# Altium schematic sheet Схема дискретных входов и выходов.SchDoc
size A2; SheetNumber: 6; SheetTotal: 6
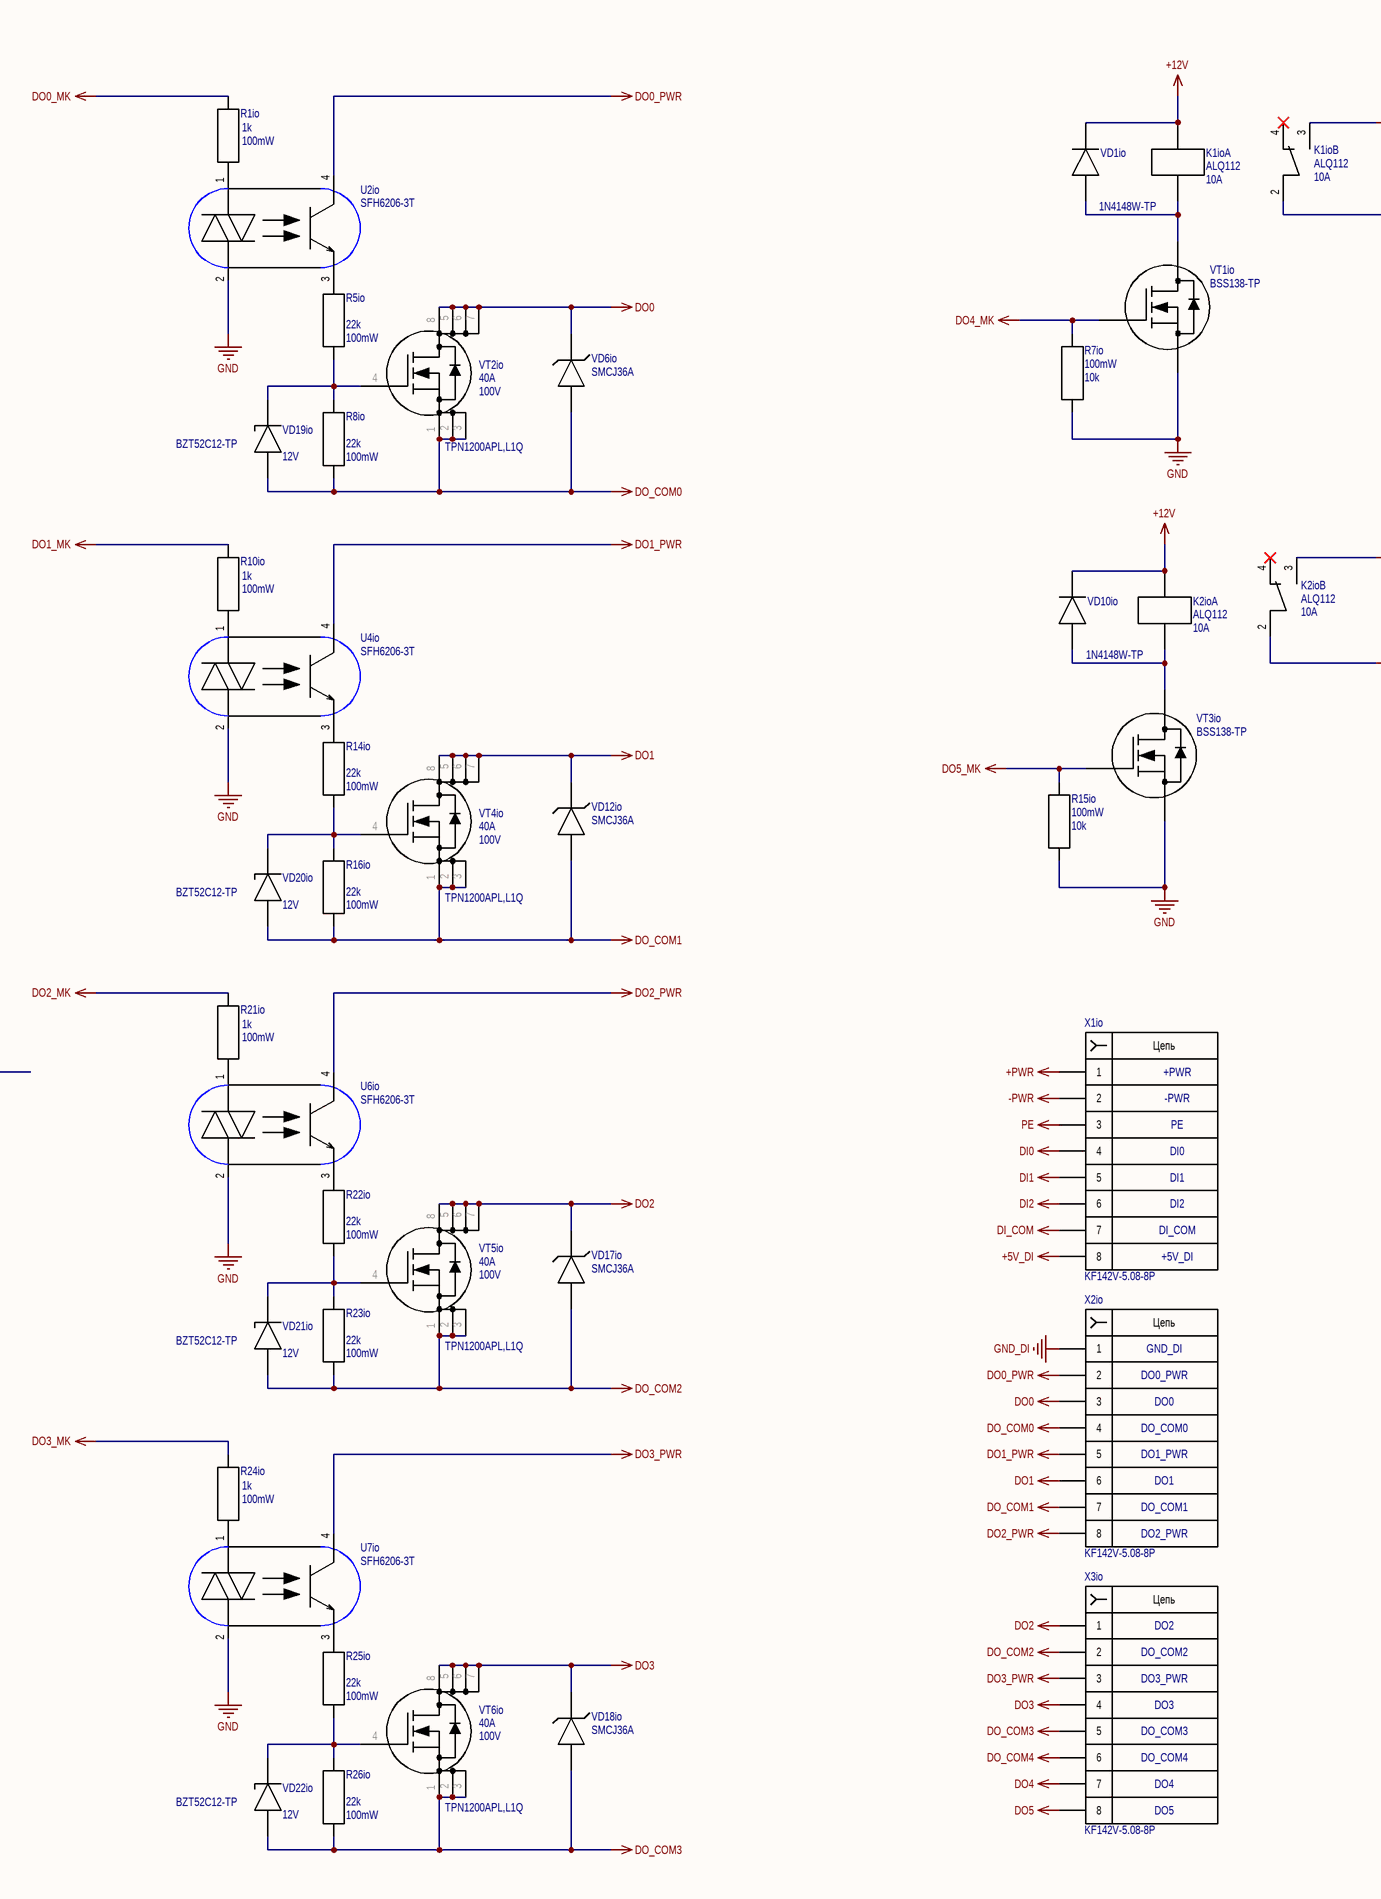
[diagram p0: Схема дискретных входов и выходов.SchDoc, left]
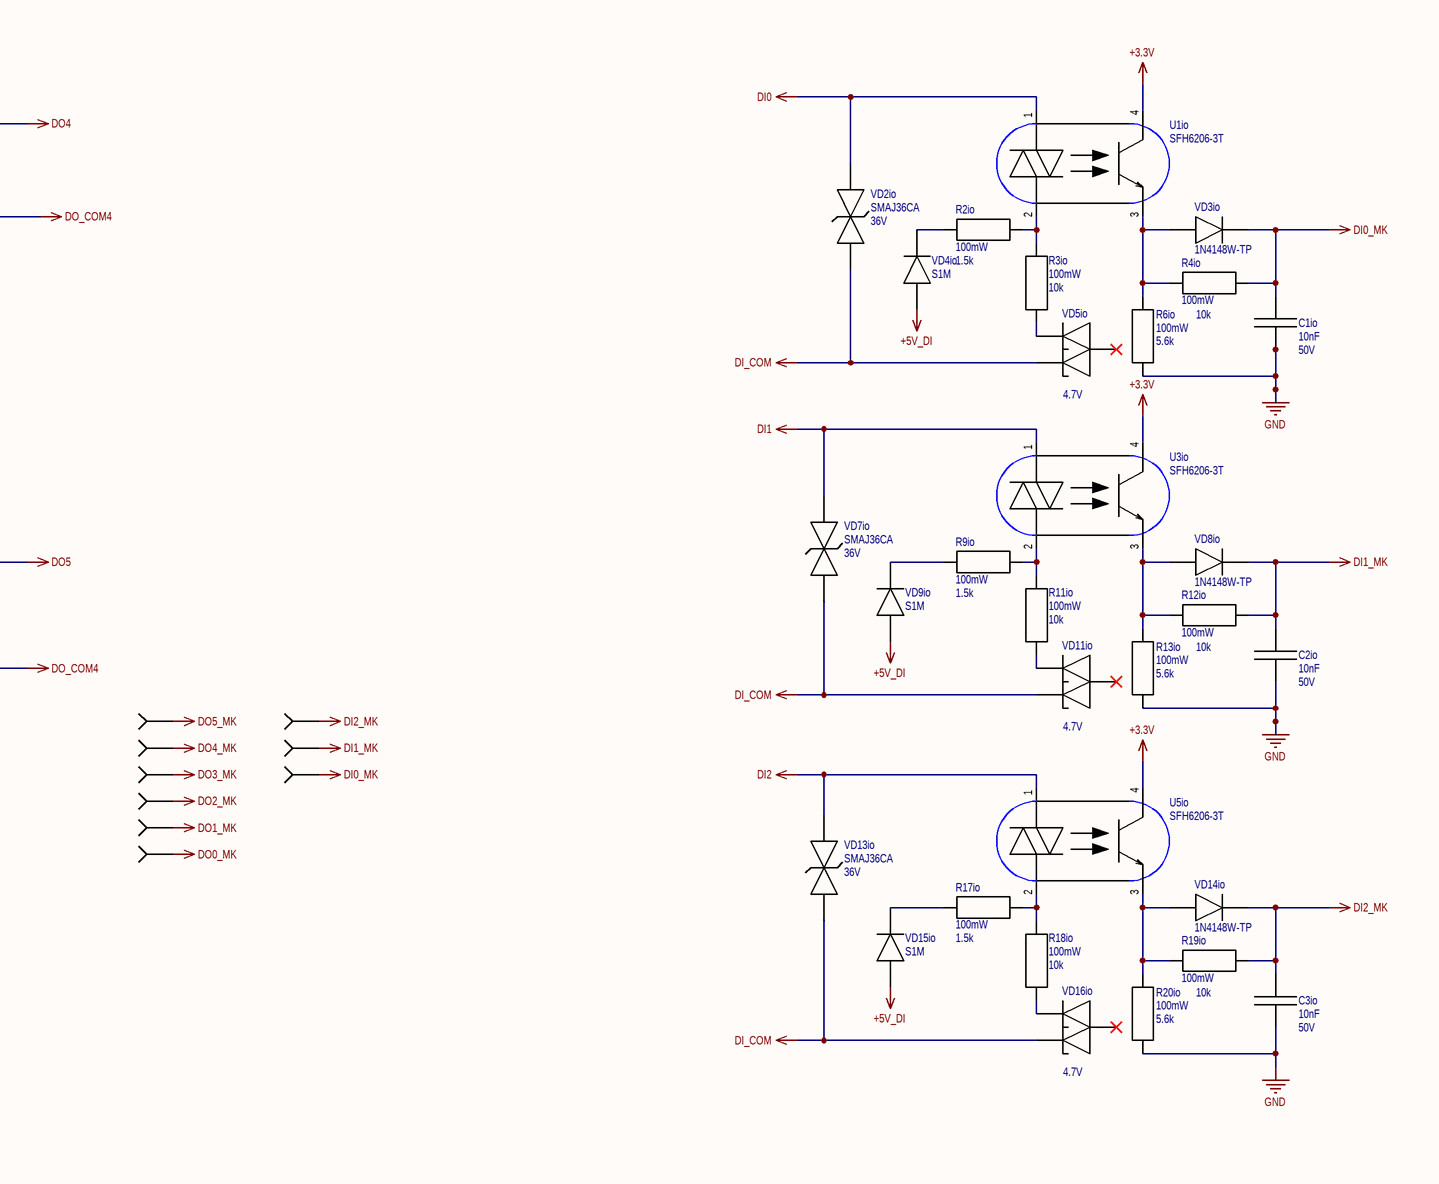
[diagram p1: Схема дискретных входов и выходов.SchDoc, right]

## Parts
C1io  Capacitance: 10nF  Rated Voltage: 50V  [CAP 0603 IPC MAX]  (hidden comment: CL10B103KB8NNNC)
C2io  Capacitance: 10nF  Rated Voltage: 50V  [CAP 0603 IPC MAX]  (hidden comment: CL10B103KB8NNNC)
C3io  Capacitance: 10nF  Rated Voltage: 50V  [CAP 0603 IPC MAX]  (hidden comment: CL10B103KB8NNNC)
K1io  ALQ112  Contact Rating: 10A  [ALQ112]  (parts A,B of 2)
K2io  ALQ112  Contact Rating: 10A  [ALQ112]  (parts A,B of 2)
R1io  Resistance: 1k  Rated Power: 100mW  [RES 0603 IPC MAX]  (hidden comment: RMCF0603FT1K00)
R2io  Power Rated: 100mW  Resistance: 1.5k  [CAP 0603 IPC MAX]  (hidden comment: RMCF0603FT1K50)
R3io  Power Rated: 100mW  Resistance: 10k  [RES 0603 IPC MAX]  (hidden comment: RMCF0603JT10K0)
R4io  Power Rated: 100mW  Resistance: 10k  [RES 0603 IPC MAX]  (hidden comment: RMCF0603JT10K0)
R5io  Resistance: 22k  Power Rated: 100mW  [RES 0603 IPC MAX]  (hidden comment: RMCF0603FT22K0)
R6io  Resistance: 5.6k  Rated Power: 100mW  [RES 0603 IPC MAX]  (hidden comment: RMCF0603FT5K60)
R7io  Power Rated: 100mW  Resistance: 10k  [RES 0603 IPC MAX]  (hidden comment: RMCF0603JT10K0)
R8io  Resistance: 22k  Power Rated: 100mW  [RES 0603 IPC MAX]  (hidden comment: RMCF0603FT22K0)
R9io  Power Rated: 100mW  Resistance: 1.5k  [CAP 0603 IPC MAX]  (hidden comment: RMCF0603FT1K50)
R10io  Resistance: 1k  Rated Power: 100mW  [RES 0603 IPC MAX]  (hidden comment: RMCF0603FT1K00)
R11io  Power Rated: 100mW  Resistance: 10k  [RES 0603 IPC MAX]  (hidden comment: RMCF0603JT10K0)
R12io  Power Rated: 100mW  Resistance: 10k  [RES 0603 IPC MAX]  (hidden comment: RMCF0603JT10K0)
R13io  Resistance: 5.6k  Rated Power: 100mW  [RES 0603 IPC MAX]  (hidden comment: RMCF0603FT5K60)
R14io  Resistance: 22k  Power Rated: 100mW  [RES 0603 IPC MAX]  (hidden comment: RMCF0603FT22K0)
R15io  Power Rated: 100mW  Resistance: 10k  [RES 0603 IPC MAX]  (hidden comment: RMCF0603JT10K0)
R16io  Resistance: 22k  Power Rated: 100mW  [RES 0603 IPC MAX]  (hidden comment: RMCF0603FT22K0)
R17io  Power Rated: 100mW  Resistance: 1.5k  [CAP 0603 IPC MAX]  (hidden comment: RMCF0603FT1K50)
R18io  Power Rated: 100mW  Resistance: 10k  [RES 0603 IPC MAX]  (hidden comment: RMCF0603JT10K0)
R19io  Power Rated: 100mW  Resistance: 10k  [RES 0603 IPC MAX]  (hidden comment: RMCF0603JT10K0)
R20io  Resistance: 5.6k  Rated Power: 100mW  [RES 0603 IPC MAX]  (hidden comment: RMCF0603FT5K60)
R21io  Resistance: 1k  Rated Power: 100mW  [RES 0603 IPC MAX]  (hidden comment: RMCF0603FT1K00)
R22io  Resistance: 22k  Power Rated: 100mW  [RES 0603 IPC MAX]  (hidden comment: RMCF0603FT22K0)
R23io  Resistance: 22k  Power Rated: 100mW  [RES 0603 IPC MAX]  (hidden comment: RMCF0603FT22K0)
R24io  Resistance: 1k  Rated Power: 100mW  [RES 0603 IPC MAX]  (hidden comment: RMCF0603FT1K00)
R25io  Resistance: 22k  Power Rated: 100mW  [RES 0603 IPC MAX]  (hidden comment: RMCF0603FT22K0)
R26io  Resistance: 22k  Power Rated: 100mW  [RES 0603 IPC MAX]  (hidden comment: RMCF0603FT22K0)
TP1io  1.2MM TP  [TESTPOINT 1.2mm]  (value not drawn)  (no BOM)
TP2io  1.2MM TP  [TESTPOINT 1.2mm]  (value not drawn)  (no BOM)
TP3io  1.2MM TP  [TESTPOINT 1.2mm]  (value not drawn)  (no BOM)
TP4io  1.2MM TP  [TESTPOINT 1.2mm]  (value not drawn)  (no BOM)
TP5io  1.2MM TP  [TESTPOINT 1.2mm]  (value not drawn)  (no BOM)
TP6io  1.2MM TP  [TESTPOINT 1.2mm]  (value not drawn)  (no BOM)
TP7io  1.2MM TP  [TESTPOINT 1.2mm]  (value not drawn)  (no BOM)
TP9io  1.2MM TP  [TESTPOINT 1.2mm]  (value not drawn)  (no BOM)
TP11io  1.2MM TP  [TESTPOINT 1.2mm]  (value not drawn)  (no BOM)
U1io  SFH6206-3T  [11-5L106]
U2io  SFH6206-3T  [11-5L106]
U3io  SFH6206-3T  [11-5L106]
U4io  SFH6206-3T  [11-5L106]
U5io  SFH6206-3T  [11-5L106]
U6io  SFH6206-3T  [11-5L106]
U7io  SFH6206-3T  [11-5L106]
VD1io  1N4148W-TP  [SOD-123 (Marked)]
VD2io  SMAJ36CA  Voltage - Reverse Standoff (Typ): 36V  [DO-214AC Bidirectional]
VD3io  1N4148W-TP  [SOD-123 (Marked)]
VD4io  S1M  [DO-214AC Unidirectional]
VD5io  Zener Voltage: 4.7V  [SOT-23-3]  (hidden comment: AZ23C4V7-HE3-08)
VD6io  SMCJ36A  [DO214-AB (SMC) L3.2W1.52]
VD7io  SMAJ36CA  Voltage - Reverse Standoff (Typ): 36V  [DO-214AC Bidirectional]
VD8io  1N4148W-TP  [SOD-123 (Marked)]
VD9io  S1M  [DO-214AC Unidirectional]
VD10io  1N4148W-TP  [SOD-123 (Marked)]
VD11io  Zener Voltage: 4.7V  [SOT-23-3]  (hidden comment: AZ23C4V7-HE3-08)
VD12io  SMCJ36A  [DO214-AB (SMC) L3.2W1.52]
VD13io  SMAJ36CA  Voltage - Reverse Standoff (Typ): 36V  [DO-214AC Bidirectional]
VD14io  1N4148W-TP  [SOD-123 (Marked)]
VD15io  S1M  [DO-214AC Unidirectional]
VD16io  Zener Voltage: 4.7V  [SOT-23-3]  (hidden comment: AZ23C4V7-HE3-08)
VD17io  SMCJ36A  [DO214-AB (SMC) L3.2W1.52]
VD18io  SMCJ36A  [DO214-AB (SMC) L3.2W1.52]
VD19io  BZT52C12-TP  Zener Voltage: 12V  [SOD-123 (Marked)]
VD20io  BZT52C12-TP  Zener Voltage: 12V  [SOD-123 (Marked)]
VD21io  BZT52C12-TP  Zener Voltage: 12V  [SOD-123 (Marked)]
VD22io  BZT52C12-TP  Zener Voltage: 12V  [SOD-123 (Marked)]
VT1io  BSS138-TP  [SOT-23-3]
VT2io  TPN1200APL,L1Q  Max Drain Current: 40A  Vds Max: 100V  [8-PowerVDFN]
VT3io  BSS138-TP  [SOT-23-3]
VT4io  TPN1200APL,L1Q  Max Drain Current: 40A  Vds Max: 100V  [8-PowerVDFN]
VT5io  TPN1200APL,L1Q  Max Drain Current: 40A  Vds Max: 100V  [8-PowerVDFN]
VT6io  TPN1200APL,L1Q  Max Drain Current: 40A  Vds Max: 100V  [8-PowerVDFN]
X1io  KF142V-5.08-8P  [KF142V-5.08-8P]
X2io  KF142V-5.08-8P  [KF142V-5.08-8P]
X3io  KF142V-5.08-8P  [KF142V-5.08-8P]

## Nets
+3.3V: U1io.4(Collector) U3io.4(Collector) U5io.4(Collector)
+5V_DI: VD4io.2 VD9io.2 VD15io.2 X1io.8
+12V: K1io.1 K2io.1 VD1io.1 VD10io.1
+PWR: X1io.1
-PWR: X1io.2
DI0: U1io.1 VD2io.2 X1io.4
DI0_MK: C1io.1 R4io.1 TP6io.1 VD3io.1
DI1: U3io.1 VD7io.2 X1io.5
DI1_MK: C2io.1 R12io.1 TP4io.1 VD8io.1
DI2: U5io.1 VD13io.2 X1io.6
DI2_MK: C3io.1 R19io.1 TP2io.1 VD14io.1
DI_COM: VD2io.1 VD5io.2 VD7io.1 VD11io.2 VD13io.1 VD16io.2 X1io.7
DO0: VD6io.2 VT2io.5 VT2io.6 VT2io.7 VT2io.8(D) X2io.3
DO0_MK: R1io.1 TP11io.1
DO0_PWR: U2io.4(Collector) X2io.2
DO1: VD12io.2 VT4io.5 VT4io.6 VT4io.7 VT4io.8(D) X2io.6
DO1_MK: R10io.1 TP9io.1
DO1_PWR: U4io.4(Collector) X2io.5
DO2: VD17io.2 VT5io.5 VT5io.6 VT5io.7 VT5io.8(D) X3io.1
DO2_MK: R21io.1 TP7io.1
DO2_PWR: U6io.4(Collector) X2io.8
DO3: VD18io.2 VT6io.5 VT6io.6 VT6io.7 VT6io.8(D) X3io.4
DO3_MK: R24io.1 TP5io.1
DO3_PWR: U7io.4(Collector) X3io.3
DO4: K1io.3 X3io.7
DO4_MK: R7io.2 TP3io.1 VT1io.1(G)
DO5: K2io.3 X3io.8
DO5_MK: R15io.2 TP1io.1 VT3io.1(G)
DO_COM0: R8io.1 VD6io.1 VD19io.2 VT2io.1(S) VT2io.2(S) VT2io.3(S) X2io.4
DO_COM1: R16io.1 VD12io.1 VD20io.2 VT4io.1(S) VT4io.2(S) VT4io.3(S) X2io.7
DO_COM2: R23io.1 VD17io.1 VD21io.2 VT5io.1(S) VT5io.2(S) VT5io.3(S) X3io.2
DO_COM3: R26io.1 VD18io.1 VD22io.2 VT6io.1(S) VT6io.2(S) VT6io.3(S) X3io.5
DO_COM4: K1io.2 K2io.2 X3io.6
GND: C1io.2 C2io.2 C3io.2 R6io.1 R7io.1 R13io.1 R15io.1 R20io.1 U2io.2 U4io.2 U6io.2 U7io.2 VT1io.2(S) VT3io.2(S)
GND_DI: X2io.1
PE: X1io.3
NetK1io_5: K1io.5 VD1io.2 VT1io.3(D)
NetK2io_5: K2io.5 VD10io.2 VT3io.3(D)
NetR1io_2: R1io.2 U2io.1
NetR2io_1: R2io.1 VD4io.1
NetR2io_2: R2io.2 R3io.2 U1io.2
NetR3io_1: R3io.1 VD5io.1
NetR4io_2: R4io.2 R6io.2 U1io.3(Emitter) VD3io.2
NetR5io_1: R5io.1 R8io.2 VD19io.1 VT2io.4(G)
NetR5io_2: R5io.2 U2io.3(Emitter)
NetR9io_1: R9io.1 VD9io.1
NetR9io_2: R9io.2 R11io.2 U3io.2
NetR10io_2: R10io.2 U4io.1
NetR11io_1: R11io.1 VD11io.1
NetR12io_2: R12io.2 R13io.2 U3io.3(Emitter) VD8io.2
NetR14io_1: R14io.1 R16io.2 VD20io.1 VT4io.4(G)
NetR14io_2: R14io.2 U4io.3(Emitter)
NetR17io_1: R17io.1 VD15io.1
NetR17io_2: R17io.2 R18io.2 U5io.2
NetR18io_1: R18io.1 VD16io.1
NetR19io_2: R19io.2 R20io.2 U5io.3(Emitter) VD14io.2
NetR21io_2: R21io.2 U6io.1
NetR22io_1: R22io.1 R23io.2 VD21io.1 VT5io.4(G)
NetR22io_2: R22io.2 U6io.3(Emitter)
NetR24io_2: R24io.2 U7io.1
NetR25io_1: R25io.1 R26io.2 VD22io.1 VT6io.4(G)
NetR25io_2: R25io.2 U7io.3(Emitter)

Not connected (* = marked no-connect by the designer): K1io 4*; K2io 4*; VD5io 3*; VD11io 3*; VD16io 3*

## Notes on the sheet
- +PWR
- -PWR
- PE
- DI0
- DI1
- DI2
- DI_COM
- +5V_DI
- GND_DI
- DO0_PWR
- DO0
- DO_COM0
- DO1_PWR
- DO1
- DO_COM1
- DO2_PWR
- DO2
- DO_COM2
- DO3_PWR
- DO3
- DO_COM3
- DO4
- DO_COM4
- DO5
- (in symbol KF142V-5.08-8P) Цепь

## Library data of the parts
C1io C2io C3io = CL10B103KB8NNNC: CAP SMD CER 10000PF 50V X7R 0603; Manufacturer 1: Samsung Electro-Mechanics; Tolerance: 10%; Type: Multilayer Ceramic; Manufacturer Part Number 1: CL10B103KB8NNNC; Min Operating Temperature: -55°C; Max Operating Temperature: 125°C; Mounting: SM; Package: 0603; Supplier 1: Digi-Key; Supplier Part Number 1: 1276-1009-1-ND
K1io K2io = ALQ112: RELAY GEN PURPOSE SPDT 10A 12V; Manufacturer 1: Panasonic Electric Works; Contact Form: SPDT (1 Form C); Max Switching Voltage: 250VAC; Coil Current: 33.3mA; Coil Resistance: 360mOhm; Coil Type: Non Latching; Manufacturer Part Number 1: ALQ112; Min Operating Temperature: -40°C; Max Operating Temperature: 85°C; Package: 20mm x 10mm x 15.6mm; Mounting: T/H; Supplier 1: Digi-Key; Supplier Part Number 1: 255-3562-ND
R1io R10io R21io R24io = RMCF0603FT1K00: RES SMD 1K OHM 1% 1/10W 0603; Manufacturer 1: Stackpole Electronics Inc; Rated Voltage: 75V; Qualification: AEC-Q200; Manufacturer Part Number 1: RMCF0603FT1K00; Tolerance: 1%; Package: 0603; Min Operating Temperature: -55°C; Max Operating Temperature: 155°C
R2io R9io R17io = RMCF0603FT1K50: RES SMD 1.5K OHM 1% 1/10W 0603; Manufacturer 1: Stackpole Electronics Inc; Voltage Rated: 75V; Manufacturer Part Number 1: RMCF0603FT1K50; Min Operating Temperature: -55°C; Max Operating Temperature: 155°C; Tolerance: 1%; Package: 0603; Ratings: AEC-Q200; Supplier 1: Digi-Key; Supplier Part Number 1: RMCF0603FT1K50CT-ND
R3io R4io R7io R11io R12io R15io R18io R19io = RMCF0603JT10K0: RES SMD 10K OHM 5% 1/10W 0603; Manufacturer 1: Stackpole Electronics Inc; Voltage Rated: 75V; Manufacturer Part Number 1: RMCF0603JT10K0; Min Operating Temperature: -55°C; Max Operating Temperature: 155°C; Tolerance: 5%; Package: 0603; Ratings: AEC-Q200; Supplier 1: Digi-Key; Supplier Part Number 1: RMCF0603JT10K0CT-ND
R5io R8io R14io R16io R22io R23io R25io R26io = RMCF0603FT22K0: RES SMD 22K OHM 1% 1/10W 0603; Manufacturer 1: Stackpole Electronics Inc; Min Operating Temnperature: -55°C; Voltage Rated: 75V; Manufacturer Part Number 1: RMCF0603FT22K0; Max Operating Temperature: 155°C; Tolerance: 1%; Package: 0603; Mounting: SM; Pins: 2; Rating: AEC-Q200; Supplier 1: Digi-Key; Supplier Part Number 1: RMCF0603FT22K0CT-ND
R6io R13io R20io = RMCF0603FT5K60: RES SMD 5.6K OHM 1% 1/10W 0603; Manufacturer Part Number 1: RMCF0603FT1K00; Manufacturer 1: Stackpole Electronics Inc; Rated Voltage: 75V; Qualification: AEC-Q200; Tolerance: 1%; Package: 0603; Min Operating Temperature: -55°C; Max Operating Temperature: 155°C
TP1io TP2io TP3io TP4io TP5io TP6io TP7io TP9io TP11io = Testpoint 1.2mm
U1io U2io U3io U4io U5io U6io U7io = SFH6206-3T: OPTOISOLATOR 5.3KV TRANS 4-SMD; Manufacturer 1: Vishay Semiconductor Opto Division; Min Current Transfer Ratio: 100%; Max Current Transfer Ratio: 320%; Output Type: Transistor; Max Output Voltage: 70V; Max Output Current: 50mA; Turn On/Off Time: 3us; Manufacturer Part Number 1: SFH6206-3T; Min Operating Temperature: -55°C; Max Operating Temperature: 100°C; Mounting: SM; Package: 4-SOIC; Rise/Fall Time: 3us
VD1io VD3io VD8io VD10io VD14io = 1N4148W-TP: DIODE GEN PURP 100V 150MA SOD123; Manufacturer 1: Micro Commercial Co; Max Voltage RMS: 71V; Maximum Forward Voltage: 1.25V; Manufacturer Part Number 1: 1N4148W-TP; Max Voltage Peak: 100V; Max Voltage DC: 100V; Max Forward Current: 150mA; Max Operating Temperature: 150°C; Min Operating Temperature: -65°C; Package: SOD-123; ComponentLink1Description: Help URL; ComponentLink1URL: *
VD2io VD7io VD13io = SMAJ36CA: TVS DIODE 36VWM 58.1VC DO214AC; Manufacturer 1: Littelfuse Inc.; Voltage - Clamping (Max) @ Ipp: 58.1V; Current - Peak Pulse (10/1000µs): 6.9A; Type: Biderectional; Number Of Chanels: 1; Max Pulse Power: 400W; Voltage - Breakdown (Min): 40V; Manufacturer Part Number 1: SMAJ36CA; Mounting: SM; Max Operating Temperature: 150°C; Min Operating Temperature: -65°C; Package: SMA; Supplier 1: Digi-Key; Supplier Part Number 1: SMAJ36CALFCT-ND
VD4io VD9io VD15io = S1M: DIODE GEN PURP 1KV 1A SMA; Manufacturer 1: SMC Diode Solutions; Max Voltage Peak: 1000V; Max Voltage RMS: 700V; Maximum Forward Voltage: 1.1V; Manufacturer Part Number 1: S1M; Max Voltage DC: 1000V; Max Forward Current: 1A; Max Operating Temperature: 175°C; Min Operating Temperature: -65°C; Package: SMA (DO-214AC); ComponentLink1Description: Help URL; ComponentLink1URL: *
VD5io VD11io VD16io = AZ23C4V7-HE3-08: DIODE ZENER ARRAY 4.7V 300MW SOT23; Manufacturer 1: Vishay General Semiconductor - Diodes Division; Tolerance: 5%; Max Impedance: 78 Ohm; Manufacturer Part Number 1: AZ23C4V7-HE3-08; Min Operating Temperature: -55°C; Max Operating Temperature: 150°C; Max Power: 300mW; Reverse Current: -; Package: SOT-23-3; Mounting: SM; Supplier 1: Digi-Key; Supplier Part Number 1: AZ23C4V7-HE3-08GICT-ND
VD6io VD12io VD17io VD18io = SMCJ36A: TVS DIODE 36VWM 58.1VC DO214AB; Manufacturer 1: Littelfuse Inc.; Typical Breakdown Voltage: 40V; Current - Peak Pulse: 25.9A; Max Pulse Power: 1500W; Max Clamping Voltage: 58.1V; Manufacturer Part Number 1: SMCJ36A; Min Operating Temperature: -55°C; Max Operating Temperature: 150°C; Package: SMC; Mounting: SM
VD19io VD20io VD21io VD22io = BZT52C12-TP: DIODE ZENER 12V 200MW SOD123; Manufacturer 1: Micro Commercial Co; Tolerance: 5%; Max Impedance: 28 Ohm; Reverse Current: 100nA; Manufacturer Part Number 1: BZT52C12-TP; Min Operating Temperature: -65°C; Max Operating Temperature: 150°C; Max Power: 200mW; Package: SOD-123; Mounting: SM; Supplier 1: Digi-Key; Supplier Part Number 1: BZT52C12-TPMSCT-ND
VT1io VT3io = BSS138-TP: MOSFET N-CH 50V 220MA SOT23; Manufacturer 1: Micro Commercial Co; Type: P-Chanel; Rds On (Max): 3.5Ohm; Vth: 1.5V; Gate Charge: 1.65nC; Vgs Max: 20V; Input Capacitance: 60pF; Max Power Dissipation: 350mW; Vds Max: 50V; Max Drain Current: 220mA; Min Operating Temperature: -55°C; Max Operating Temperature: 150°C; Mounting Type: SM; Package: SOT-23; Manufacturer Part Number 1: BSS138-TP; Supplier 1: Digi-Key; Supplier Part Number 1: BSS138-TPMSCT-ND
VT2io VT4io VT5io VT6io = TPN1200APL,L1Q: MOSFET N-CH 100V 42A MLPAK33; Manufacturer 1: Toshiba Semiconductor and Storage; Type: N-MOSFET; Rds On (Max): 11.5mOhm; Vth: 2.5V; Gate Charge: 24nC; Vgs Max: 20V; Input Capacitance: 1855pF; Max Power Dissipation: 630mW; Min Operating Temperature: -55°C; Max Operating Temperature: 175°C; Mounting Type: SM; Package: 8-PowerVDFN; Manufacturer Part Number 1: TPN1200APL,L1Q; Supplier 1: DigiKey; Supplier Part Number 1: 264-TPN1200APLL1QCT-ND
X1io X2io X3io = KF142V-5.08-8P: TERMINAL BLOCK 8 PIN 5.08mm 15A 250V T/H; pin to pad: 1>1+9 2>2+10 3>3+11 4>4+12 5>5+13 6>6+14 7>7+15 8>8+16; Manufacturer 1: CIXI KEFA ELECTRONICS CO.,LTD.; Rated Current: 10A; Suitable Wire: 14...22AWG; Pitch: 5.08mm x 7.62mm; Rated Voltage: 250V; Min Operating Temperatire: -40℃; Max Operating Temperature: 105℃; Pins: 8+8; Manufacturer Part Number 1: KF142V-5.08-8P; Max Length: 43.18mm; Max Width: 13.7mm; Max Height: 14.2mm